# EAGLE design FreeBee (EAGLE 5.11)
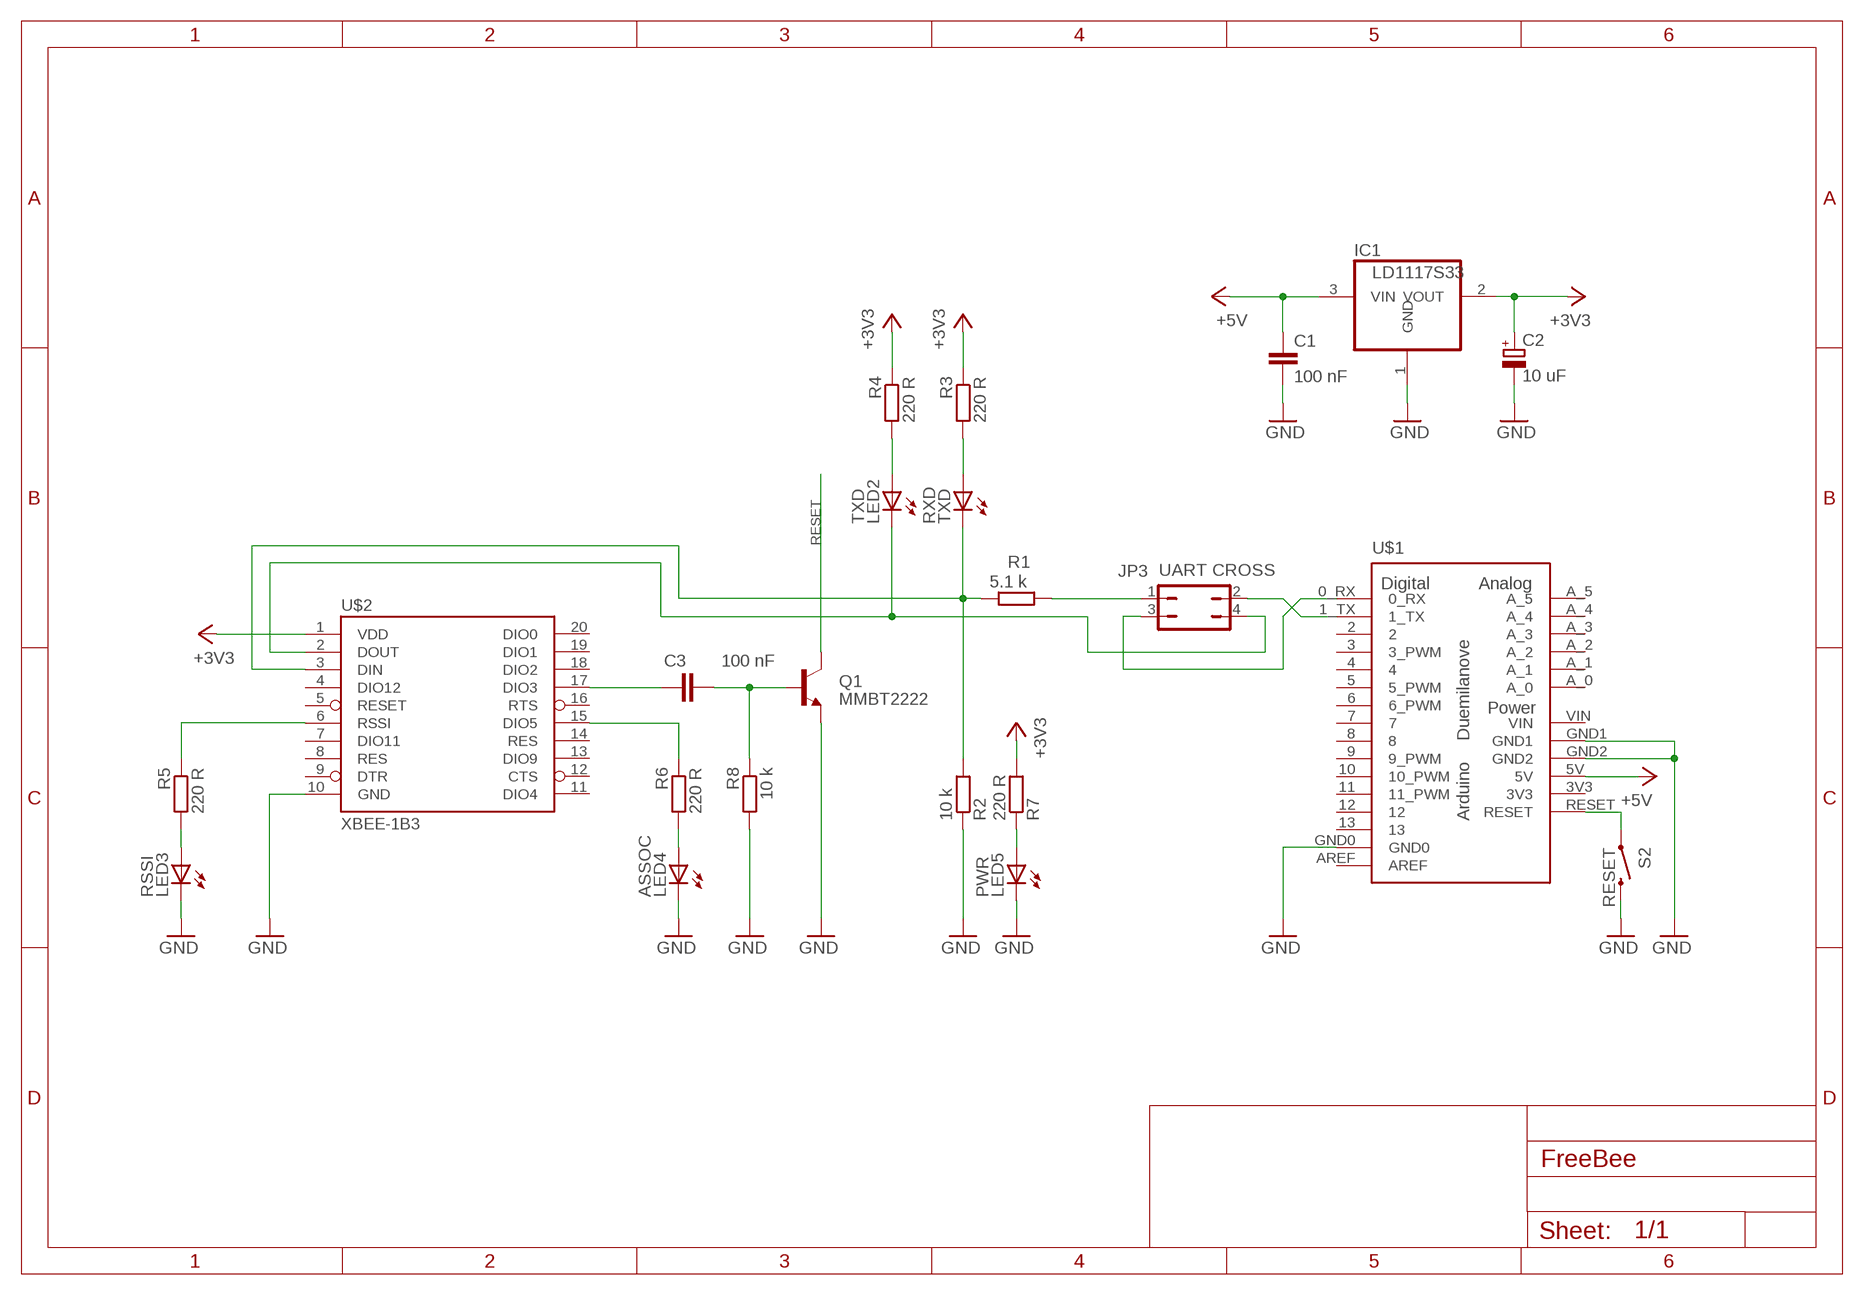
[diagram p0: schematic, sheet 1]

## Parts
C1  100 nF  C-EUC0805K  [C0805K]
C2  10 uF  CPOL-EUSMCC  [SMC_C]
C3  100 nF  C-EUC0805K  [C0805K]
IC1  LD1117S33  REG1117  [SOT223]
JP3  UART CROSS  JP2Q  [JP2Q]
LED2  TXD  LEDCHIPLED_0805  [CHIPLED_0805]
LED3  RSSI  LEDCHIPLED_0805  [CHIPLED_0805]
LED4  ASSOC  LEDCHIPLED_0805  [CHIPLED_0805]
LED5  PWR  LEDCHIPLED_0805  [CHIPLED_0805]
Q1  MMBT2222  TRANSISTOR_NPNSOT23  [SOT23]
R1  5.1 k  R-EU_M0805  [M0805]
R2  10 k  R-EU_M0805  [M0805]
R3  220 R  R-EU_M0805  [M0805]
R4  220 R  R-EU_M0805  [M0805]
R5  220 R  R-EU_M0805  [M0805]
R6  220 R  R-EU_M0805  [M0805]
R7  220 R  R-EU_M0805  [M0805]
R8  10 k  R-EU_M0805  [M0805]
S2  RESET  SWITCH-MOMENTARY-2-SMD-1101NE  [TACTILE-SWITCH-1101NE]
TXD  RXD  LEDCHIPLED_0805  [CHIPLED_0805]
U$1  ARDUINO-USBLONG_PADS_TEXT  [SHIELD]
U$2  XBEE-1B3  [XBEE-SMD]

## Nets
+3V3: C2.+ IC1.2(VOUT) R3.1 R4.1 R7.2 U$2.1(VDD)
+5V: C1.1 IC1.3(VIN) U$1.5V
GND: C1.2 C2.- IC1.1(GND) LED3.C LED4.C LED5.C Q1.2(E) R2.1 R8.2 S2.P$2 U$1.GND0 U$1.GND1 U$1.GND2 U$2.10(GND)
N$1: JP3.2 U$1.1_TX
N$2: R5.1 U$2.6(RSSI)
N$3: R6.1 U$2.15(DIO5)
N$4: R1.1 R2.2 TXD.C U$2.3(DIN)
N$5: LED4.A R6.2
N$6: JP3.3 U$1.0_RX
N$7: LED5.A R7.1
N$8: LED3.A R5.2
N$9: R3.2 TXD.A
N$10: LED2.A R4.2
N$12: JP3.1 R1.2
N$117: C3.1 U$2.17(DIO3)
N$119: C3.2 Q1.1(B) R8.1
RESET: Q1.3(C) S2.P$1 U$1.RESET
RXD: JP3.4 LED2.C U$2.2(DOUT)
Unconnected: U$1.2 U$1.3(3_PWM) U$1.4 U$1.5(5_PWM) U$1.6(6_PWM) U$1.7 U$1.8 U$1.9(9_PWM) U$1.10(10_PWM) U$1.11(11_PWM) U$1.12 U$1.13 U$1.A_0 U$1.A_1 U$1.A_2 U$1.A_3 U$1.A_4 U$1.A_5 U$1.AREF U$2.4(DIO12) U$2.5(RESET) U$2.7(DIO11) U$2.8(RES) U$2.9(DTR) U$2.11(DIO4) U$2.12(CTS) U$2.13(DIO9) U$2.14(RES) U$2.16(RTS) U$2.18(DIO2) U$2.19(DIO1) U$2.20(DIO0)

## Power pins joined to a net without a drawn wire
3V3: U$1.3V3
VIN: U$1.VIN

## Library data of the parts
C1 C3 = rcl:C-EU: CAPACITOR, European symbol
C2 = rcl:CPOL-EU: POLARIZED CAPACITOR, European symbol
IC1 = burr-brown:REG1117: 800mA and 1A Low Dropout (LDO) Positive Regulator 1.8V, 2.5V, 2.85V, 3.3V, 5V, and Adj
JP3 = jumper:JP2Q: JUMPER
LED2-LED5 TXD = led:LED: LED OSRAM: - CHIPLED LG R971, LG N971, LY N971, LG Q971, LY Q971, LO R971, LY R971 LH N974, LH R974 LS Q976, LO Q976, LY Q976 LO Q996 - Hyper CHIPLED LW Q18S LB Q993, LB Q99A, LB R99A - SideLED LS A670, LO A670, LY A670, LG A670, LP A670 LB A673, LV A673, LT A673, LW A673 LH A674 LY A675 LS A676, LA A676, LO A676, LY A676, LW A676 LS A679, LY A679, LG A679 - Hyper Micro SIDELED® LS Y876, LA Y876, LO Y876, LY Y876 LT Y87S - SmartLED LW L88C, LW L88S LB L89C, LB L89S, LG L890 LS L89K, LO L89K, LY L89K LS L896, LA L896, LO L896, LY L896 - TOPLED LS T670, LO T670, LY T670, LG T670, LP T670 LSG T670, LSP T670, LSY T670, LOP T670, LYG T670 LG T671, LOG T671, LSG T671 LB T673, LV T673, LT T673, LW T673 LH T674 LS T676, LA T676, LO T676, LY T676, LB T676, LH T676, LSB T676, LW T676 LB T67C, LV T67C, LT T67C, LS T67K, LO T67K, LY T67K, LW E67C LS E67B, LA E67B, LO E67B, LY E67B, LB E67C, LV E67C, LT E67C LW T67C LS T679, LY T679, LG T679 LS T770, LO T770, LY T770, LG T770, LP T770 LB T773, LV T773, LT T773, LW T773 LH T774 LS E675, LA E675, LY E675, LS T675 LS T776, LA T776, LO T776, LY T776, LB T776 LHGB T686 LT T68C, LB T68C - Hyper Mini TOPLED® LB M676 - Mini TOPLED Santana® LG M470 LS M47K, LO M47K, LY M47K Source: http://www.osram.convergy.de LUXEON: - LUMILED® LXK2-PW12-R00, LXK2-PW12-S00, LXK2-PW14-U00, LXK2-PW14-V00 LXK2-PM12-R00, LXK2-PM12-S00, LXK2-PM14-U00 LXK2-PE12-Q00, LXK2-PE12-R00, LXK2-PE12-S00, LXK2-PE14-T00, LXK2-PE14-U00 LXK2-PB12-K00, LXK2-PB12-L00, LXK2-PB12-M00, LXK2-PB14-N00, LXK2-PB14-P00, LXK2-PB14-Q00 LXK2-PR12-L00, LXK2-PR12-M00, LXK2-PR14-Q00, LXK2-PR14-R00 LXK2-PD12-Q00, LXK2-PD12-R00, LXK2-PD12-S00 LXK2-PH12-R00, LXK2-PH12-S00 LXK2-PL12-P00, LXK2-PL12-Q00, LXK2-PL12-R00 Source: www.luxeon.com KINGBRIGHT: KA-3528ASYC Source: www.kingbright.com
Q1 = SparkFun:TRANSISTOR_NPN: Transistor NPN BJT configuration in SOT23 package. MMBT2222 is the common NPN we use. Double check BCE configuration again layout.
R1-R8 = resistor:R-EU_: RESISTOR, European symbol
S2 = SparkFun:SWITCH-MOMENTARY-2
U$1 = Arduino-Various:ARDUINO-USB: The Ardiuno Duemilanove Pinouts layoutet as a Bare Shield. v0.5 Also for Arduino Diecimila. This is designed as a Part and has no Outline in the Dimension Layer. The Outline, when present, is drawed at the tPlace / bPlace Layer. Library by Stephanie Lange, http://www.k-ita.de/~sl/
U$2 = SparkFun:XBEE-1

## Board
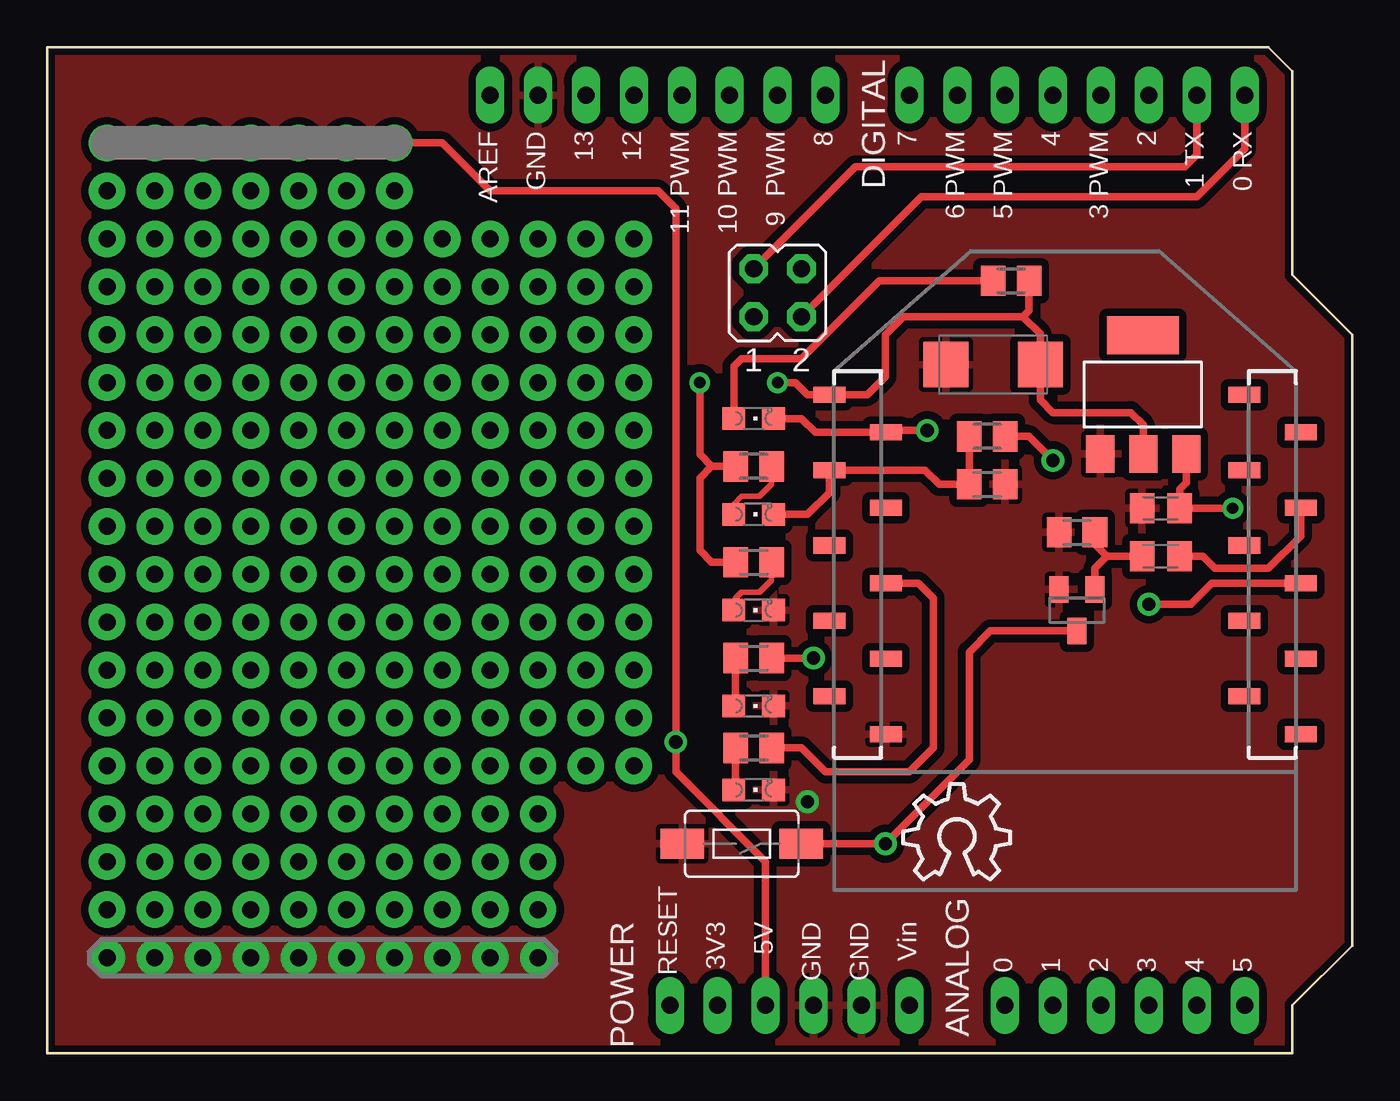
[diagram p1: board, top side]
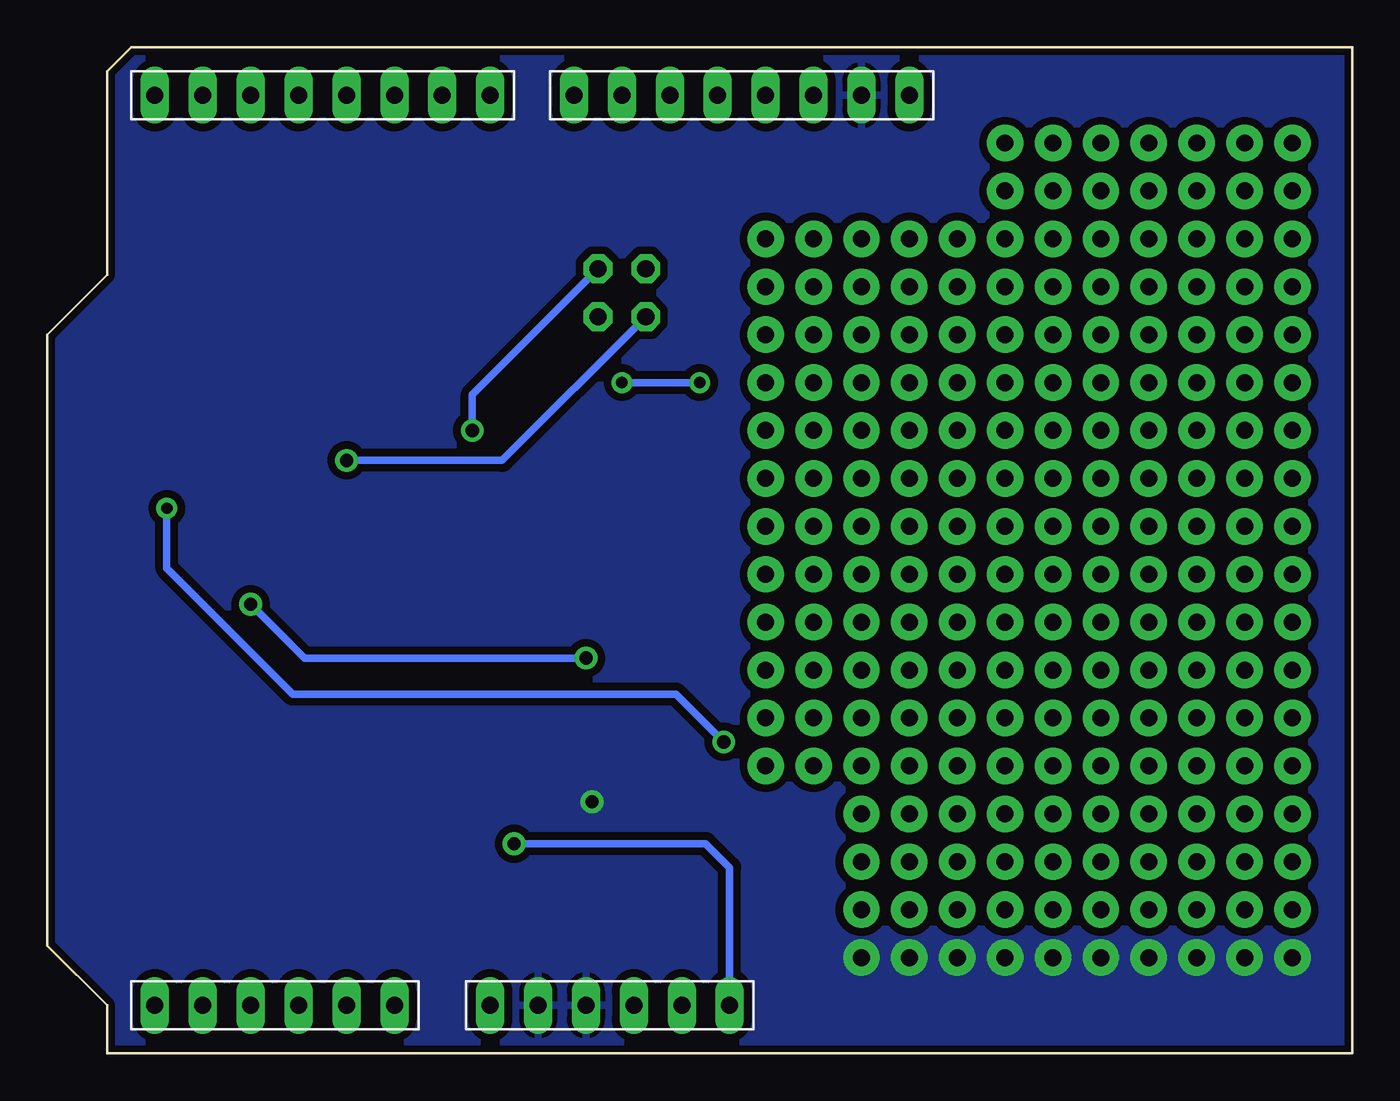
[diagram p2: board, bottom side, seen from below]

Size 69.22 x 53.34 mm. Coordinates in mm from the lower left corner, seen from the top.
Outline: 64.77,53.34 66.04,52.07 66.04,41.27 69.22,38.1 69.22,5.72 66.04,2.54 66.04,0 0,0 0,53.34 64.77,53.34
Copper layers (1*16): Top 0.035mm / dielectric 1.5mm / Bottom 0.035mm
Design rules "SparkFun.drc": minimum track width 8mil, minimum drill 20mil, track to track 8mil, track to pad 8mil, pad to pad 8mil, via to via 8mil, smd to smd 8mil, copper to edge 10mil, drill to drill 8mil, minimum pad ring 12mil, minimum via ring 10mil, stop-mask expansion 4mil, vias tented up to drill 25mil, thermal gap 10mil

### Footprints (pad centres in the part's own frame; a part is rotated, then mirrored left to right if it is on the bottom)
C0805K = smd 1.3 x 1.6: 1 -1,0; 2 1,0
SMC_C = smd 2.4 x 2.4: + -2.5,0; - 2.5,0
SOT223 = smd 1.499 x 2.007: 1 -2.261,-3.15; 2 0.025,-3.15; 3 2.311,-3.15 | smd 3.81 x 2.007: 4 0,3.15
JP2Q = drill 0.914 octagon: 1 -1.27,-1.27; 2 -1.27,1.27; 3 1.27,-1.27; 4 1.27,1.27
CHIPLED_0805 = smd 1.2 x 1.2: A 0,-1.05; C 0,1.05
SOT23 = smd 1 x 1.4: 1 -0.95,-1.1; 2 0.95,-1.1; 3 0,1.1
M0805 = smd 1.3 x 1.6: 1 -0.95,0; 2 0.95,0
TACTILE-SWITCH-1101NE = smd 2.3 x 1.6: P$1 -3.15,0; P$2 3.15,0
SHIELD = drill 0.9 pad 1.27 long: 0_RX -25.4,27.94; 1_TX -25.4,25.4; 2 -25.4,22.86; 3 -25.4,20.32; 3V3 22.86,0; 4 -25.4,17.78; 5 -25.4,15.24; 5V 22.86,2.54; 6 -25.4,12.7; 7 -25.4,10.16; 8 -25.4,5.715; 9 -25.4,3.175; 10 -25.4,0.635; 11 -25.4,-1.905; 12 -25.4,-4.445; 13 -25.4,-6.985; A_0 22.86,15.24; A_1 22.86,17.78; A_2 22.86,20.32; A_3 22.86,22.86; A_4 22.86,25.4; A_5 22.86,27.94; AREF -25.4,-12.065; GND0 -25.4,-9.525; GND1 22.86,7.62; GND2 22.86,5.08; RESET 22.86,-2.54; VIN 22.86,10.16
XBEE-SMD = smd 1.7 x 0.85: 1 -12.5,20; 2 -9.5,18; 3 -12.5,16; 4 -9.5,14; 5 -12.5,12; 6 -9.5,10; 7 -12.5,8; 8 -9.5,6; 9 -12.5,4; 10 -9.5,2; 11 12.5,2; 12 9.5,4; 13 12.5,6; 14 9.5,8; 15 12.5,10; 16 9.5,12; 17 12.5,14; 18 9.5,16; 19 12.5,18; 20 9.5,20

### Placement (x,y rotation side)
C1  59.05,28.89 180 top
C2  50.16,36.51 180 top
C3  59.05,26.35 180 top
IC1  58.1,34.93 0 top
JP3  38.73,40.32 0 top
LED2  37.46,33.66 270 top
LED3  37.46,13.97 270 top
LED4  37.46,18.41 270 top
LED5  37.46,23.5 270 top
Q1  54.61,23.5 180 top
R1  49.85,32.7 0 top
R2  49.85,30.16 180 top
R3  37.46,31.12 0 top
R4  51.12,40.96 180 top
R5  37.46,16.19 180 top
R6  37.46,20.96 180 top
R7  37.46,26.04 180 top
R8  54.61,27.62 180 top
S2  36.83,11.11 180 top
TXD  37.46,28.57 270 top
U$1  35.56,25.4 270 top
U$2  53.98,14.92 0 top
U$3  [OSHW_8X200_NOTEXT]  45.4,9.21 0 top

### Tracks (layer width: path | path; a pad name or v marks a point on that pad's centre or on a via)
+3V3  (via drill 0.6)
  Top 0.406: IC1.2 58.13,33.31 57.47,33.97 53.34,33.97 52.66,34.65 C2.+ 52.66,38.14 51.75,39.05 | 51.75,39.05 45.4,39.05 44.45,38.1 44.45,35.88 43.49,34.92 U$2.1 40.32,34.93 39.69,35.56 v38.73,35.56 | 51.75,39.05 52.07,39.37 R4.1 | R7.2 35.24,26.04 34.61,26.67 34.61,30.48 35.24,31.12 | 35.24,31.12 R3.1 | 35.24,31.12 34.61,31.75 v34.61,35.56
  Bottom 0.406: v34.61,35.56 v38.73,35.56
+5V  (via drill 0.6, 0.7, 0.9 pad 1.93)
  Top 0.406: IC1.3 60.41,30.25 60.05,29.89 C1.1 v62.86,28.89 | v18.41,48.26 20.95,48.26 23.49,45.72 32.38,45.72 33.34,44.77 v33.34,16.51 33.34,14.92 38.1,10.16 U$1.5V
  Top 0.61: v3.17,48.26 v5.71,48.26 v8.26,48.26 v10.79,48.26 v13.34,48.26 v15.88,48.26 v18.41,48.26
  Bottom 0.406: v33.34,16.51 35.88,19.05 56.2,19.05 62.86,25.72 v62.86,28.89
GND  (via drill 0.7, 0.9 pad 1.93)
  other vias: 3.17,5.08 5.71,5.08 8.26,5.08 10.79,5.08 13.34,5.08 15.88,5.08 18.41,5.08 20.95,5.08 23.49,5.08 26.04,5.08 40.32,13.34
  pour Top (isolate 0.406): -3.17,55.88 71.75,55.88 71.75,-3.81 -3.17,-3.81
  pour Bottom (isolate 0.406): -2.54,54.61 70.8,54.61 70.8,-2.22 -2.54,-2.22
N$1
  Top 0.406: U$1.1_TX 60.96,47.62 60.32,46.99 42.86,46.99 JP3.2
N$2
  Top 0.406: R5.1 40,16.19 41.27,14.92 45.72,14.92 46.99,16.19 46.99,24.13 46.2,24.92 U$2.6
N$3  (via drill 0.7)
  Top 0.406: R6.1 v40.64,20.96 | U$2.15 61.75,24.92 60.64,23.81 v58.42,23.81
  Bottom 0.406: v40.64,20.96 55.56,20.96 v58.42,23.81
N$4
  Top 0.406: R1.1 R2.2 47.31,30.16 46.55,30.92 U$2.3 41.48,29.73 40.32,28.57 TXD.C
N$5
  Top 0.406: R6.2 36.52,18.52 LED4.A
N$6
  Top 0.406: JP3.3 46.35,45.4 60.96,45.4 63.5,47.94 U$1.0_RX
N$7
  Top 0.305: 36.52,23.6 36.52,24.13 36.83,24.45 37.78,24.45 38.42,25.08 R7.1
  Top 0.406: LED5.A 36.52,23.6
N$8
  Top 0.406: R5.2 36.52,14.07 LED3.A
N$9
  Top 0.305: TXD.A 36.41,29.11 36.83,29.53 37.78,29.53 38.42,30.16 R3.2
  Top 0.406: R3.2 38.1,30.8
N$10
  Top 0.406: R4.2 44.13,40.96 40,36.83 36.83,36.83 36.41,36.41 LED2.A
N$11  (via drill 0.9 pad 1.93)
  other vias: 3.17,38.1
N$12  (via drill 0.7)
  Top 0.406: R1.2 52.07,32.7 v53.34,31.43
  Bottom 0.406: v53.34,31.43 45.09,31.43 JP3.1
N$13  (via drill 0.9 pad 1.93)
  other vias: 3.17,35.56
N$14  (via drill 0.9 pad 1.93)
  other vias: 3.17,33.02
N$15  (via drill 0.9 pad 1.93)
  other vias: 8.26,30.48
N$16  (via drill 0.9 pad 1.93)
  other vias: 8.26,27.94
N$17  (via drill 0.9 pad 1.93)
  other vias: 8.26,25.4
N$18  (via drill 0.9 pad 1.93)
  other vias: 8.26,22.86
N$19  (via drill 0.9 pad 1.93)
  other vias: 10.79,30.48
N$20  (via drill 0.9 pad 1.93)
  other vias: 8.26,7.62
N$27  (via drill 0.9 pad 1.93)
  other vias: 20.95,40.64
N$28  (via drill 0.9 pad 1.93)
  other vias: 23.49,7.62
N$29  (via drill 0.9 pad 1.93)
  other vias: 20.95,7.62
N$30  (via drill 0.9 pad 1.93)
  other vias: 18.41,7.62
N$31  (via drill 0.9 pad 1.93)
  other vias: 15.88,7.62
N$32  (via drill 0.9 pad 1.93)
  other vias: 31.12,38.1
N$33  (via drill 0.9 pad 1.93)
  other vias: 31.12,40.64
N$35  (via drill 0.9 pad 1.93)
  other vias: 13.34,7.62
N$36  (via drill 0.9 pad 1.93)
  other vias: 3.17,40.64
N$37  (via drill 0.9 pad 1.93)
  other vias: 3.17,43.18
N$38  (via drill 0.9 pad 1.93)
  other vias: 31.12,35.56
N$39  (via drill 0.9 pad 1.93)
  other vias: 28.57,40.64
N$40  (via drill 0.9 pad 1.93)
  other vias: 26.04,40.64
N$41  (via drill 0.9 pad 1.93)
  other vias: 23.49,40.64
N$42  (via drill 0.9 pad 1.93)
  other vias: 10.79,7.62
N$43  (via drill 0.9 pad 1.93)
  other vias: 8.26,10.16
N$44  (via drill 0.9 pad 1.93)
  other vias: 18.41,45.72
N$45  (via drill 0.9 pad 1.93)
  other vias: 18.41,43.18
N$46  (via drill 0.9 pad 1.93)
  other vias: 18.41,40.64
N$47  (via drill 0.9 pad 1.93)
  other vias: 18.41,38.1
N$48  (via drill 0.9 pad 1.93)
  other vias: 20.95,38.1
N$49  (via drill 0.9 pad 1.93)
  other vias: 23.49,38.1
N$50  (via drill 0.9 pad 1.93)
  other vias: 26.04,38.1
N$51  (via drill 0.9 pad 1.93)
  other vias: 28.57,38.1
N$52  (via drill 0.9 pad 1.93)
  other vias: 28.57,35.56
N$53  (via drill 0.9 pad 1.93)
  other vias: 8.26,12.7
N$54  (via drill 0.9 pad 1.93)
  other vias: 8.26,15.24
N$55  (via drill 0.9 pad 1.93)
  other vias: 8.26,17.78
N$56  (via drill 0.9 pad 1.93)
  other vias: 8.26,20.32
N$57  (via drill 0.9 pad 1.93)
  other vias: 13.34,30.48
N$58  (via drill 0.9 pad 1.93)
  other vias: 10.79,27.94
N$59  (via drill 0.9 pad 1.93)
  other vias: 5.71,33.02
N$60  (via drill 0.9 pad 1.93)
  other vias: 5.71,35.56
N$61  (via drill 0.9 pad 1.93)
  other vias: 5.71,38.1
N$62  (via drill 0.9 pad 1.93)
  other vias: 5.71,40.64
N$63  (via drill 0.9 pad 1.93)
  other vias: 5.71,43.18
N$64  (via drill 0.9 pad 1.93)
  other vias: 5.71,45.72
N$65  (via drill 0.9 pad 1.93)
  other vias: 10.79,25.4
N$66  (via drill 0.9 pad 1.93)
  other vias: 8.26,45.72
N$67  (via drill 0.9 pad 1.93)
  other vias: 15.88,30.48
N$68  (via drill 0.9 pad 1.93)
  other vias: 18.41,30.48
N$69  (via drill 0.9 pad 1.93)
  other vias: 20.95,30.48
N$70  (via drill 0.9 pad 1.93)
  other vias: 15.88,45.72
N$71  (via drill 0.9 pad 1.93)
  other vias: 13.34,45.72
N$72  (via drill 0.9 pad 1.93)
  other vias: 10.79,45.72
N$73  (via drill 0.9 pad 1.93)
  other vias: 15.88,38.1
N$74  (via drill 0.9 pad 1.93)
  other vias: 15.88,40.64
N$75  (via drill 0.9 pad 1.93)
  other vias: 15.88,43.18
N$76  (via drill 0.9 pad 1.93)
  other vias: 26.04,35.56
N$77  (via drill 0.9 pad 1.93)
  other vias: 15.88,35.56
N$78  (via drill 0.9 pad 1.93)
  other vias: 18.41,35.56
N$79  (via drill 0.9 pad 1.93)
  other vias: 20.95,35.56
N$80  (via drill 0.9 pad 1.93)
  other vias: 23.49,35.56
N$81  (via drill 0.9 pad 1.93)
  other vias: 15.88,33.02
N$82  (via drill 0.9 pad 1.93)
  other vias: 18.41,33.02
N$83  (via drill 0.9 pad 1.93)
  other vias: 13.34,33.02
N$84  (via drill 0.9 pad 1.93)
  other vias: 10.79,33.02
N$85  (via drill 0.9 pad 1.93)
  other vias: 8.26,33.02
N$86  (via drill 0.9 pad 1.93)
  other vias: 8.26,35.56
N$87  (via drill 0.9 pad 1.93)
  other vias: 10.79,35.56
N$88  (via drill 0.9 pad 1.93)
  other vias: 13.34,35.56
N$89  (via drill 0.9 pad 1.93)
  other vias: 13.34,38.1
N$90  (via drill 0.9 pad 1.93)
  other vias: 10.79,38.1
N$91  (via drill 0.9 pad 1.93)
  other vias: 8.26,38.1
N$92  (via drill 0.9 pad 1.93)
  other vias: 8.26,40.64
N$93  (via drill 0.9 pad 1.93)
  other vias: 8.26,43.18
N$94  (via drill 0.9 pad 1.93)
  other vias: 10.79,43.18
N$95  (via drill 0.9 pad 1.93)
  other vias: 10.79,40.64
N$96  (via drill 0.9 pad 1.93)
  other vias: 13.34,40.64
N$97  (via drill 0.9 pad 1.93)
  other vias: 13.34,43.18
N$98  (via drill 0.9 pad 1.93)
  other vias: 23.49,30.48
N$99  (via drill 0.9 pad 1.93)
  other vias: 13.34,27.94
N$100  (via drill 0.9 pad 1.93)
  other vias: 10.79,22.86
N$101  (via drill 0.9 pad 1.93)
  other vias: 10.79,20.32
N$102  (via drill 0.9 pad 1.93)
  other vias: 3.17,45.72
N$104  (via drill 0.9 pad 1.93)
  other vias: 10.79,17.78
N$105  (via drill 0.9 pad 1.93)
  other vias: 10.79,15.24
N$106  (via drill 0.9 pad 1.93)
  other vias: 10.79,12.7
N$107  (via drill 0.9 pad 1.93)
  other vias: 10.79,10.16
N$108  (via drill 0.9 pad 1.93)
  other vias: 15.88,27.94
N$109  (via drill 0.9 pad 1.93)
  other vias: 18.41,27.94
N$110  (via drill 0.9 pad 1.93)
  other vias: 20.95,27.94
N$111  (via drill 0.9 pad 1.93)
  other vias: 23.49,27.94
N$112  (via drill 0.9 pad 1.93)
  other vias: 23.49,25.4
N$113  (via drill 0.9 pad 1.93)
  other vias: 20.95,25.4
N$114  (via drill 0.9 pad 1.93)
  other vias: 18.41,25.4
N$115  (via drill 0.9 pad 1.93)
  other vias: 15.88,25.4
N$116  (via drill 0.9 pad 1.93)
  other vias: 13.34,25.4
N$117
  Top 0.406: C3.1 61.28,26.35 61.91,25.72 64.77,25.72 66.47,27.42 U$2.17
N$119
  Top 0.406: R8.1 55.56,26.99 56.2,26.35 | 56.2,26.35 C3.2 | Q1.1 55.56,25.72 56.2,26.35
N$120  (via drill 0.9 pad 1.93)
  other vias: 23.49,10.16
N$121  (via drill 0.9 pad 1.93)
  other vias: 23.49,12.7
N$122  (via drill 0.9 pad 1.93)
  other vias: 23.49,15.24
N$123  (via drill 0.9 pad 1.93)
  other vias: 23.49,17.78
N$124  (via drill 0.9 pad 1.93)
  other vias: 23.49,20.32
N$125  (via drill 0.9 pad 1.93)
  other vias: 23.49,22.86
N$126  (via drill 0.9 pad 1.93)
  other vias: 13.34,22.86
N$127  (via drill 0.9 pad 1.93)
  other vias: 13.34,17.78
N$128  (via drill 0.9 pad 1.93)
  other vias: 13.34,20.32
N$129  (via drill 0.9 pad 1.93)
  other vias: 13.34,15.24
N$130  (via drill 0.9 pad 1.93)
  other vias: 13.34,12.7
N$131  (via drill 0.9 pad 1.93)
  other vias: 13.34,10.16
N$132  (via drill 0.9 pad 1.93)
  other vias: 15.88,10.16
N$133  (via drill 0.9 pad 1.93)
  other vias: 15.88,12.7
N$134  (via drill 0.9 pad 1.93)
  other vias: 26.04,7.62
N$135  (via drill 0.9 pad 1.93)
  other vias: 26.04,10.16
N$136  (via drill 0.9 pad 1.93)
  other vias: 26.04,12.7
N$137  (via drill 0.9 pad 1.93)
  other vias: 20.95,33.02
N$138  (via drill 0.9 pad 1.93)
  other vias: 5.71,30.48
N$139  (via drill 0.9 pad 1.93)
  other vias: 5.71,27.94
N$140  (via drill 0.9 pad 1.93)
  other vias: 5.71,25.4
N$141  (via drill 0.9 pad 1.93)
  other vias: 5.71,22.86
N$142  (via drill 0.9 pad 1.93)
  other vias: 15.88,15.24
N$144  (via drill 0.9 pad 1.93)
  other vias: 3.17,7.62
N$145  (via drill 0.9 pad 1.93)
  other vias: 3.17,10.16
N$146  (via drill 0.9 pad 1.93)
  other vias: 3.17,12.7
N$147  (via drill 0.9 pad 1.93)
  other vias: 3.17,15.24
N$148  (via drill 0.9 pad 1.93)
  other vias: 31.12,43.18
N$149  (via drill 0.9 pad 1.93)
  other vias: 23.49,33.02
N$150  (via drill 0.9 pad 1.93)
  other vias: 26.04,33.02
N$151  (via drill 0.9 pad 1.93)
  other vias: 28.57,33.02
N$152  (via drill 0.9 pad 1.93)
  other vias: 31.12,33.02
N$153  (via drill 0.9 pad 1.93)
  other vias: 15.88,17.78
N$154  (via drill 0.9 pad 1.93)
  other vias: 15.88,20.32
N$155  (via drill 0.9 pad 1.93)
  other vias: 15.88,22.86
N$156  (via drill 0.9 pad 1.93)
  other vias: 18.41,22.86
N$157  (via drill 0.9 pad 1.93)
  other vias: 28.57,43.18
N$158  (via drill 0.9 pad 1.93)
  other vias: 31.12,15.24
N$159  (via drill 0.9 pad 1.93)
  other vias: 26.04,43.18
N$160  (via drill 0.9 pad 1.93)
  other vias: 23.49,43.18
N$161  (via drill 0.9 pad 1.93)
  other vias: 31.12,17.78
N$162  (via drill 0.9 pad 1.93)
  other vias: 31.12,20.32
N$163  (via drill 0.9 pad 1.93)
  other vias: 31.12,22.86
N$164  (via drill 0.9 pad 1.93)
  other vias: 31.12,25.4
N$165  (via drill 0.9 pad 1.93)
  other vias: 20.95,43.18
N$166  (via drill 0.9 pad 1.93)
  other vias: 31.12,27.94
N$167  (via drill 0.9 pad 1.93)
  other vias: 31.12,30.48
N$168  (via drill 0.9 pad 1.93)
  other vias: 28.57,15.24
N$169  (via drill 0.9 pad 1.93)
  other vias: 26.04,15.24
N$170  (via drill 0.9 pad 1.93)
  other vias: 5.71,20.32
N$177  (via drill 0.9 pad 1.93)
  other vias: 5.71,7.62
N$178  (via drill 0.9 pad 1.93)
  other vias: 5.71,10.16
N$179  (via drill 0.9 pad 1.93)
  other vias: 5.71,12.7
N$180  (via drill 0.9 pad 1.93)
  other vias: 5.71,15.24
N$181  (via drill 0.9 pad 1.93)
  other vias: 5.71,17.78
N$184  (via drill 0.9 pad 1.93)
  other vias: 26.04,17.78
N$185  (via drill 0.9 pad 1.93)
  other vias: 26.04,20.32
N$186  (via drill 0.9 pad 1.93)
  other vias: 26.04,22.86
N$187  (via drill 0.9 pad 1.93)
  other vias: 26.04,25.4
N$188  (via drill 0.9 pad 1.93)
  other vias: 26.04,27.94
N$189  (via drill 0.9 pad 1.93)
  other vias: 26.04,30.48
N$190  (via drill 0.9 pad 1.93)
  other vias: 28.57,30.48
N$191  (via drill 0.9 pad 1.93)
  other vias: 28.57,27.94
N$192  (via drill 0.9 pad 1.93)
  other vias: 28.57,25.4
N$193  (via drill 0.9 pad 1.93)
  other vias: 28.57,22.86
N$194  (via drill 0.9 pad 1.93)
  other vias: 28.57,20.32
N$195  (via drill 0.9 pad 1.93)
  other vias: 28.57,17.78
N$196  (via drill 0.9 pad 1.93)
  other vias: 20.95,22.86
N$197  (via drill 0.9 pad 1.93)
  other vias: 18.41,10.16
N$198  (via drill 0.9 pad 1.93)
  other vias: 20.95,10.16
N$199  (via drill 0.9 pad 1.93)
  other vias: 20.95,12.7
N$200  (via drill 0.9 pad 1.93)
  other vias: 18.41,12.7
N$201  (via drill 0.9 pad 1.93)
  other vias: 18.41,15.24
N$202  (via drill 0.9 pad 1.93)
  other vias: 18.41,17.78
N$203  (via drill 0.9 pad 1.93)
  other vias: 18.41,20.32
N$204  (via drill 0.9 pad 1.93)
  other vias: 20.95,20.32
N$205  (via drill 0.9 pad 1.93)
  other vias: 20.95,17.78
N$206  (via drill 0.9 pad 1.93)
  other vias: 20.95,15.24
N$207  (via drill 0.9 pad 1.93)
  other vias: 3.17,30.48
N$208  (via drill 0.9 pad 1.93)
  other vias: 3.17,27.94
N$209  (via drill 0.9 pad 1.93)
  other vias: 3.17,25.4
N$210  (via drill 0.9 pad 1.93)
  other vias: 3.17,22.86
N$211  (via drill 0.9 pad 1.93)
  other vias: 3.17,20.32
N$212  (via drill 0.9 pad 1.93)
  other vias: 3.17,17.78
RESET  (via drill 0.7)
  Top 0.406: Q1.3 50.02,22.39 48.89,21.27 48.89,15.56 v44.45,11.11 S2.P$1
  Bottom 0.406: U$1.RESET 33.02,9.84 34.29,11.11 v44.45,11.11
RXD  (via drill 0.7)
  Top 0.406: LED2.C 40,33.66 40.74,32.92 U$2.2 44.57,33.02 v46.67,33.02
  Bottom 0.406: JP3.4 46.67,34.93 v46.67,33.02

### Text on the board
Reference: CROSS | NORMAL | TXD | RXD | PWR | ASC | RSSI | RESET
tDocu: +5V | * | * | 220 R | LD1117S33 | 10 uF | 5.1 k | 220 R | 10 k | 10 k | 220 R | 2 x 100 nF | 220 R | 220 R | Arduino Shield for Digi XBee | (or compatible 3.3V modules) | Luke Weston, 2011 | GND